# Altium schematic sheet 01-Microcontroller.SchDoc: Microcontroller
size A3; Engineer: Juan M Garin; Organization: ESO; Address1: Juan M Garin; DocumentNumber: 1; Revision: 1.0; SheetNumber: 1; SheetTotal: 6
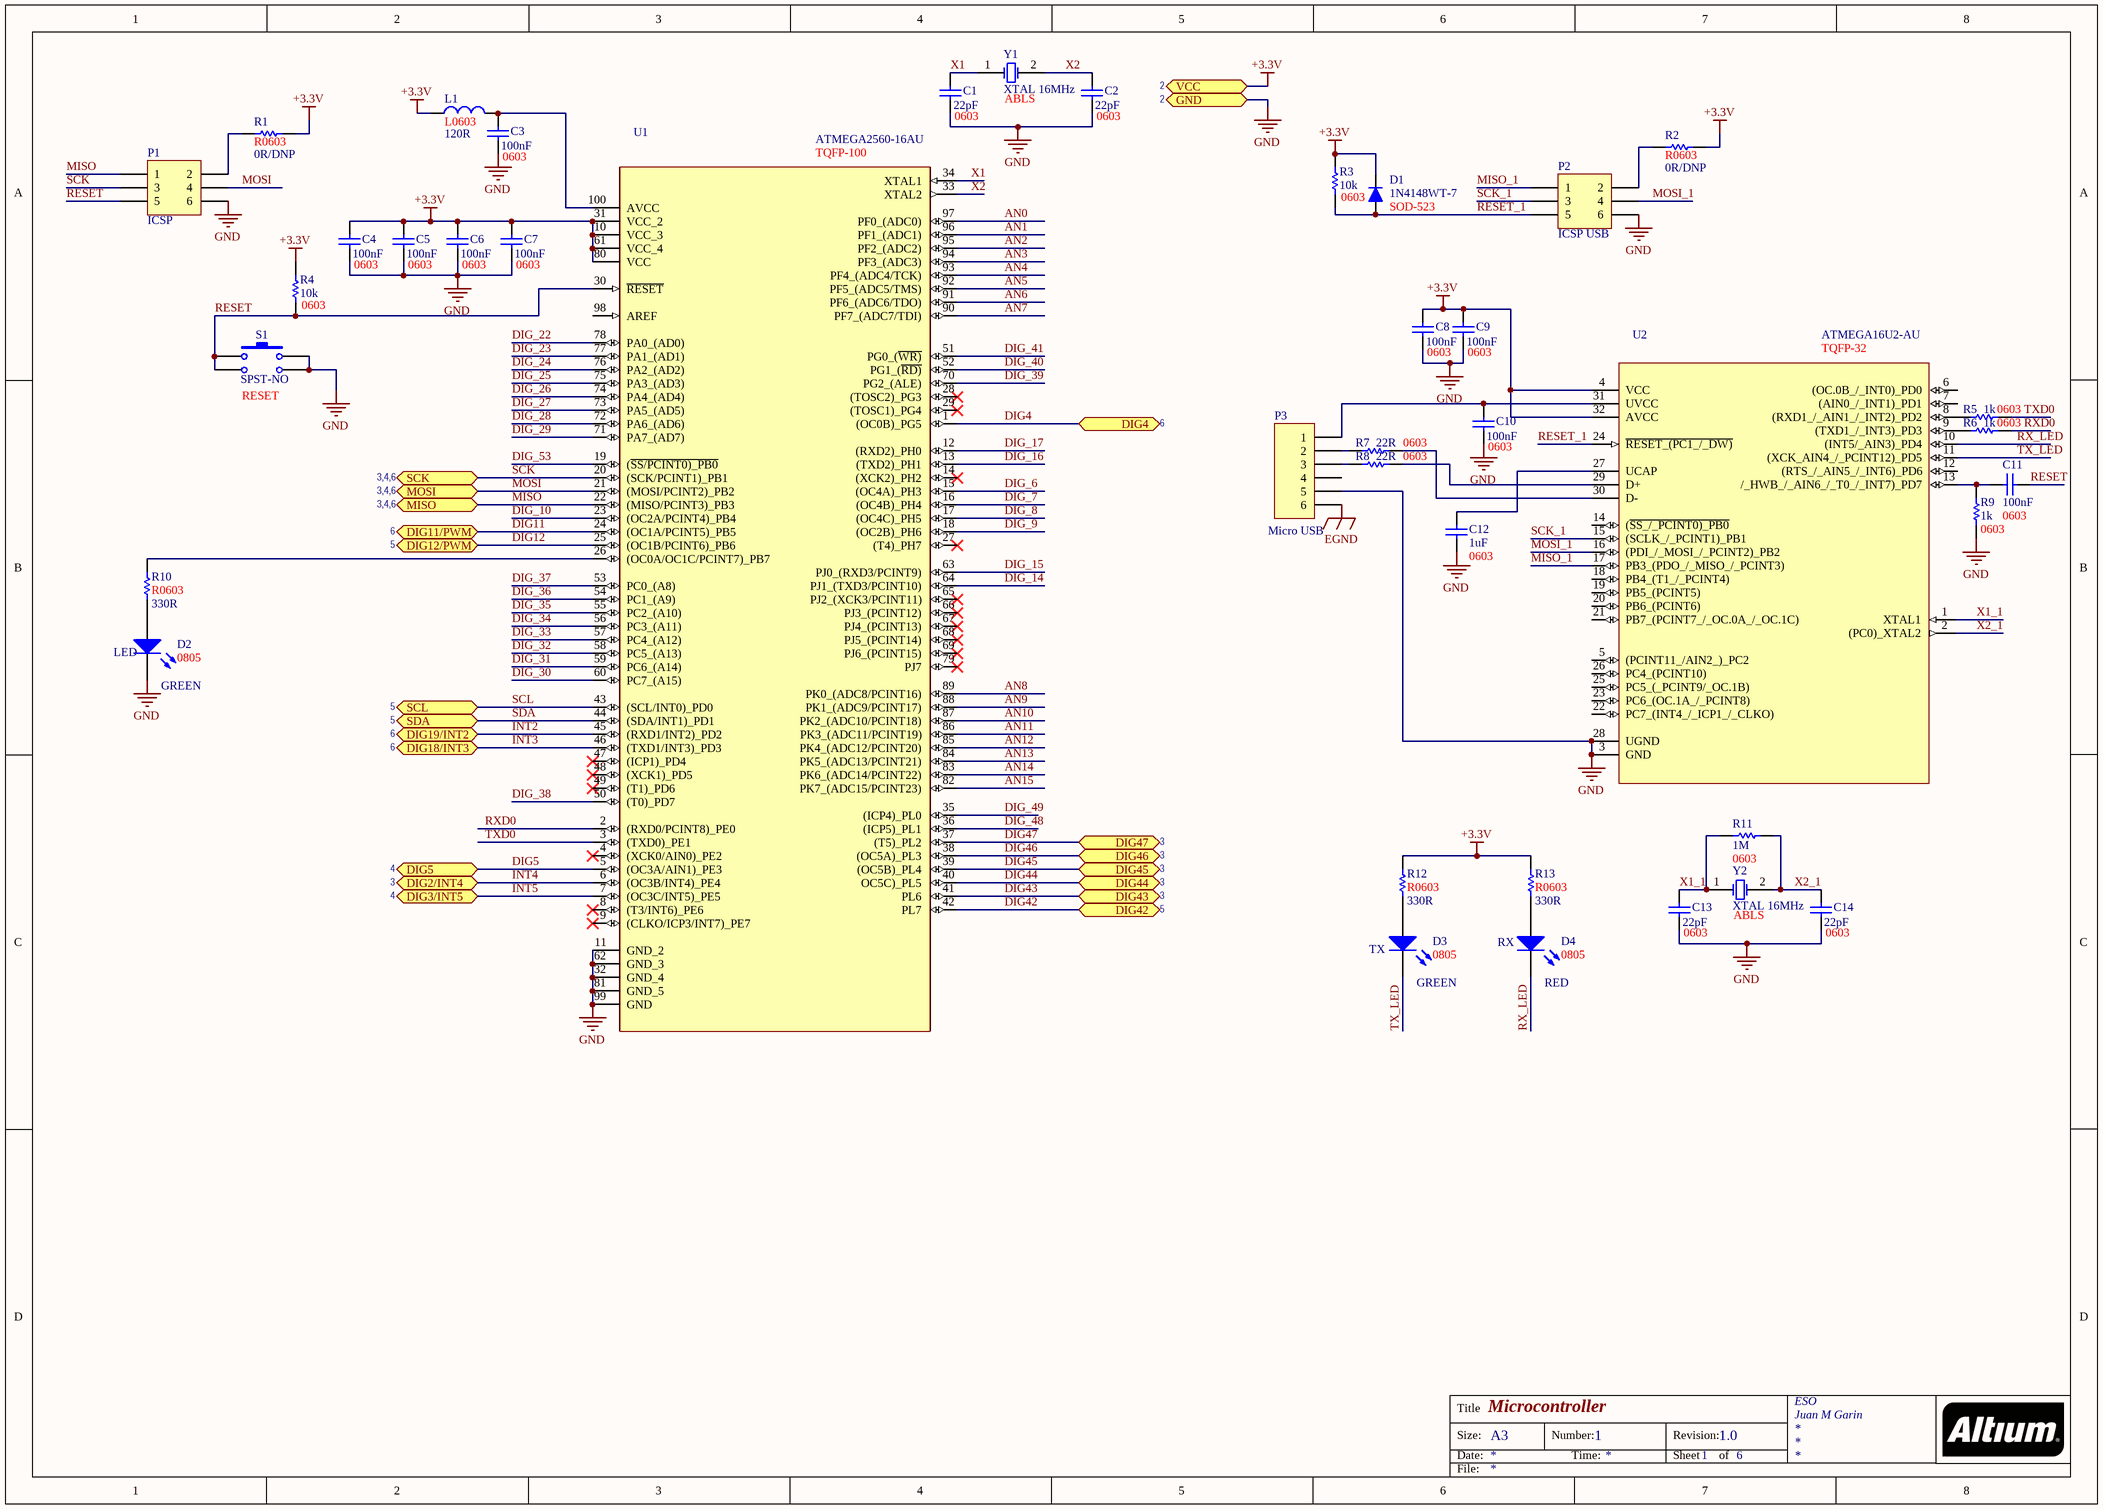
[diagram p0: 01-Microcontroller.SchDoc]

## Parts
C1  22pF  PackageReference: 0603  [C0603]
C2  22pF  PackageReference: 0603  [C0603]
C3  100nF  PackageReference: 0603  [C0603]
C4  100nF  PackageReference: 0603  [C0603]
C5  100nF  PackageReference: 0603  [C0603]
C6  100nF  PackageReference: 0603  [C0603]
C7  100nF  PackageReference: 0603  [C0603]
C8  100nF  PackageReference: 0603  [C0603]
C9  100nF  PackageReference: 0603  [C0603]
C10  100nF  PackageReference: 0603  [C0603]
C11  100nF  PackageReference: 0603  [C0603]
C12  1uF  PackageReference: 0603  [C0603]
C13  22pF  PackageReference: 0603  [C0603]
C14  22pF  PackageReference: 0603  [C0603]
D1  1N4148WT-7  PackageReference: SOD-523  [SOD523]
D2  LED  value GREEN  PackageReference: 0805  [LED0805]
D3  TX  value GREEN  PackageReference: 0805  [LED0805]
D4  RX  value RED  PackageReference: 0805  [LED0805]
L1  120R  [L0603]
P1  ICSP  [HDR2X3]
P2  ICSP USB  [HDR2X3]
P3  Micro USB  [CON_MOLEX_105133-0011]
R1  0R/DNP  [R0603]
R2  0R/DNP  [R0603]
R3  10k  PackageReference: 0603  [R0603]
R4  10k  PackageReference: 0603  [R0603]
R5  1k  PackageReference: 0603  [R0603]
R6  1k  PackageReference: 0603  [R0603]
R7  22R  PackageReference: 0603  [R0603]
R8  22R  PackageReference: 0603  [R0603]
R9  1k  PackageReference: 0603  [R0603]
R10  330R  [R0603]
R11  1M  PackageReference: 0603  [R0603]
R12  330R  [R0603]
R13  330R  [R0603]
S1  SPST-NO  Function: RESET  [DPST-4]
U1  ATMEGA2560-16AU  PackageReference: TQFP-100  [TQFP100]
U2  ATMEGA16U2-AU  Package: TQFP-32  [32A_N]
Y1  XTAL 16MHz  PackageReference: ABLS  [XTAL-SMD]
Y2  XTAL 16MHz  PackageReference: ABLS  [XTAL-SMD]

## Ports
DIG2/INT4, DIG3/INT5, DIG4, DIG5, DIG11/PWM, DIG12/PWM, DIG18/INT3, DIG19/INT2, DIG42, DIG43, DIG44, DIG45, DIG46, DIG47, GND, MISO, MOSI, SCK, SCL, SDA, VCC

## Nets
+3.3V: C4.2 C5.2 C6.2 C7.2 C8.2 C9.2 D1.2(K) L1.1 R1.2 R2.2 R3.1 R4.1 R12.2 R13.2 U1.10(VCC_3) U1.31(VCC_2) U1.61(VCC_4) U1.80(VCC) U2.4(VCC) U2.32(AVCC) ; port VCC
EGND: P3.6
GND: C1.1 C2.1 C3.1 C4.1 C5.1 C6.1 C7.1 C8.1 C9.1 C10.1 C12.2 C13.1 C14.1 D2.2(K) P1.6 P2.6 P3.5 R9.1 S1.3 S1.4 U1.11(GND_2) U1.32(GND_4) U1.62(GND_3) U1.81(GND_5) U1.99(GND) U2.3(GND) U2.28(UGND) ; port GND
AN0: U1.97(PF0_(ADC0))
AN1: U1.96(PF1_(ADC1))
AN2: U1.95(PF2_(ADC2))
AN3: U1.94(PF3_(ADC3))
AN4: U1.93(PF4_(ADC4/TCK))
AN5: U1.92(PF5_(ADC5/TMS))
AN6: U1.91(PF6_(ADC6/TDO))
AN7: U1.90(PF7_(ADC7/TDI))
AN8: U1.89(PK0_(ADC8/PCINT16))
AN9: U1.88(PK1_(ADC9/PCINT17))
AN10: U1.87(PK2_(ADC10/PCINT18))
AN11: U1.86(PK3_(ADC11/PCINT19))
AN12: U1.85(PK4_(ADC12/PCINT20))
AN13: U1.84(PK5_(ADC13/PCINT21))
AN14: U1.83(PK6_(ADC14/PCINT22))
AN15: U1.82(PK7_(ADC15/PCINT23))
DIG4: U1.1((OC0B)_PG5) ; port DIG4
DIG5: U1.5((OC3A/AIN1)_PE3) ; port DIG5
DIG11: U1.24((OC1A/PCINT5)_PB5) ; port DIG11/PWM
DIG12: U1.25((OC1B/PCINT6)_PB6) ; port DIG12/PWM
DIG42: U1.42(PL7) ; port DIG42
DIG43: U1.41(PL6) ; port DIG43
DIG44: U1.40(OC5C)_PL5) ; port DIG44
DIG45: U1.39((OC5B)_PL4) ; port DIG45
DIG46: U1.38((OC5A)_PL3) ; port DIG46
DIG47: U1.37((T5)_PL2) ; port DIG47
DIG_6: U1.15((OC4A)_PH3)
DIG_7: U1.16((OC4B)_PH4)
DIG_8: U1.17((OC4C)_PH5)
DIG_9: U1.18((OC2B)_PH6)
DIG_10: U1.23((OC2A/PCINT4)_PB4)
DIG_14: U1.64(PJ1_(TXD3/PCINT10))
DIG_15: U1.63(PJ0_(RXD3/PCINT9))
DIG_16: U1.13((TXD2)_PH1)
DIG_17: U1.12((RXD2)_PH0)
DIG_22: U1.78(PA0_(AD0))
DIG_23: U1.77(PA1_(AD1))
DIG_24: U1.76(PA2_(AD2))
DIG_25: U1.75(PA3_(AD3))
DIG_26: U1.74(PA4_(AD4))
DIG_27: U1.73(PA5_(AD5))
DIG_28: U1.72(PA6_(AD6))
DIG_29: U1.71(PA7_(AD7))
DIG_30: U1.60(PC7_(A15))
DIG_31: U1.59(PC6_(A14))
DIG_32: U1.58(PC5_(A13))
DIG_33: U1.57(PC4_(A12))
DIG_34: U1.56(PC3_(A11))
DIG_35: U1.55(PC2_(A10))
DIG_36: U1.54(PC1_(A9))
DIG_37: U1.53(PC0_(A8))
DIG_38: U1.50((T0)_PD7)
DIG_39: U1.70(PG2_(ALE))
DIG_40: U1.52(PG1_(~{RD)})
DIG_41: U1.51(PG0_(~{WR)})
DIG_48: U1.36((ICP5)_PL1)
DIG_49: U1.35((ICP4)_PL0)
DIG_53: U1.19((~{SS/PCINT0)_PB0})
INT2: U1.45((RXD1/INT2)_PD2) ; port DIG19/INT2
INT3: U1.46((TXD1/INT3)_PD3) ; port DIG18/INT3
INT4: U1.6((OC3B/INT4)_PE4) ; port DIG2/INT4
INT5: U1.7((OC3C/INT5)_PE5) ; port DIG3/INT5
MISO: P1.1 U1.22((MISO/PCINT3)_PB3) ; port MISO
MISO_1: P2.1 U2.17(PB3_(PDO_/_MISO_/_PCINT3))
MOSI: P1.4 U1.21((MOSI/PCINT2)_PB2) ; port MOSI
MOSI_1: P2.4 U2.16((PDI_/_MOSI_/_PCINT2)_PB2)
RESET: C11.1 P1.5 R4.2 S1.1 S1.2 U1.30(~{RESET})
RESET_1: D1.1(A) P2.5 R3.2 U2.24(~{RESET_(PC1_/_DW)})
RX_LED: D4.2(K) U2.10((INT5/_AIN3)_PD4)
RXD0: R6.2 U1.2((RXD0/PCINT8)_PE0)
SCK: P1.3 U1.20((SCK/PCINT1)_PB1) ; port SCK
SCK_1: P2.3 U2.15((SCLK_/_PCINT1)_PB1)
SCL: U1.43((SCL/INT0)_PD0) ; port SCL
SDA: U1.44((SDA/INT1)_PD1) ; port SDA
TX_LED: D3.2(K) U2.11((XCK_AIN4_/_PCINT12)_PD5)
TXD0: R5.2 U1.3((TXD0)_PE1)
X1: C1.2 U1.34(XTAL1) Y1.1(OSC1)
X1_1: C13.2 R11.2 U2.1(XTAL1) Y2.1(OSC1)
X2: C2.2 U1.33(XTAL2) Y1.2(OSC2)
X2_1: C14.2 R11.1 U2.2((PC0)_XTAL2) Y2.2(OSC2)
NetC3_2: C3.2 L1.2 U1.100(AVCC)
NetC10_2: C10.2 P3.1 U2.31(UVCC)
NetC11_2: C11.2 R9.2 U2.13(/_HWB_/_AIN6_/_T0_/_INT7)_PD7)
NetC12_1: C12.1 U2.27(UCAP)
NetD2_1: D2.1(A) R10.1
NetD3_1: D3.1(A) R12.1
NetD4_1: D4.1(A) R13.1
NetP1_2: P1.2 R1.1
NetP2_2: P2.2 R2.1
NetP3_2: P3.2 R7.2
NetP3_3: P3.3 R8.2
NetR5_1: R5.1 U2.8((RXD1_/_AIN1_/_INT2)_PD2)
NetR6_1: R6.1 U2.9((TXD1_/_INT3)_PD3)
NetR7_1: R7.1 U2.30(D-)
NetR8_1: R8.1 U2.29(D+)
NetR10_2: R10.2 U1.26((OC0A/OC1C/PCINT7)_PB7)

Not connected (* = marked no-connect by the designer): P3 4; U1 4((XCK0/AIN0)_PE2)* 8((T3/INT6)_PE6)* 9((CLKO/ICP3/INT7)_PE7)* 14((XCK2)_PH2)* 27((T4)_PH7)* 28((TOSC2)_PG3)* 29((TOSC1)_PG4)* 47((ICP1)_PD4)* 48((XCK1)_PD5)* 49((T1)_PD6)* 65(PJ2_(XCK3/PCINT11))* 66(PJ3_(PCINT12))* 67(PJ4_(PCINT13))* 68(PJ5_(PCINT14))* 69(PJ6_(PCINT15))* 79(PJ7)* 98(AREF); U2 5((PCINT11_/AIN2_)_PC2) 6((OC.0B_/_INT0)_PD0) 7((AIN0_/_INT1)_PD1) 12((RTS_/_AIN5_/_INT6)_PD6) 14((~{SS_/_PCINT0)_PB0}) 18(PB4_(T1_/_PCINT4)) 19(PB5_(PCINT5)) 20(PB6_(PCINT6)) 21(PB7_(PCINT7_/_OC.0A_/_OC.1C)) 22(PC7_(INT4_/_ICP1_/_CLKO)) 23(PC6_(OC.1A_/_PCINT8)) 25(PC5_(_PCINT9/_OC.1B)) 26(PC4_(PCINT10))

## Notes on the sheet
- 2
- 6
- 3,4,6
- 5
- 3
- 4
- Title
- Size:
- Date:
- A3
- Number:
- Time:
- Revision:
- Sheet
- of
- File:

## Library data of the parts
C1 C2 C13 C14 = Cap Semi: Capacitor (Semiconductor SIM Model); Manufacturer Part Number: 885012006004; Value: 22pF
C3-C11 = Cap Semi: Capacitor (Semiconductor SIM Model); Manufacturer Part Number: CL10F104ZO8NNNC; Value: 100nF
C12 = Cap Semi: Capacitor (Semiconductor SIM Model); Manufacturer Part Number: CL10A105KQ8NNNC; Value: 1uF
D1 = DIODE: Manufacturer Part Number: 1N4148WT-7
D2 D3 = LED_SMD: GREEN; Manufacturer Part Number: LTST-S220GKT
D4 = LED_SMD: YLW; Manufacturer Part Number: LTST-C171KRKT
L1 = Inductor_0603: Inductor; Manufacturer Part Number: BLM18PG121SN1D; PackageReference: L0603; Value: 120R
P1 P2 = Header 3X2: Header, 3-Pin, Dual row; Manufacturer Part Number: 5-146254-3
P3 = Header 6: CONN MICRO USB B 2.0 VERT SMT; Manufacturer Part Number: 1051330011
R1 R2 = Res_0402: Resistor; Manufacturer Part Number: CR0603-J/-000ELF; PackageReference: R0603; Value: 0R/DNP
R3 R4 = Res1: Resistor; Manufacturer Part Number: RMCF0603FT10K0; Value: 10k
R5 R6 R9 = Res1: Resistor; Manufacturer Part Number: RMCF0603FG1K00; Value: 1k
R7 R8 = Res1: Resistor; Manufacturer Part Number: CRGCQ0603J22R; Value: 22R
R10 R12 R13 = Res_0402: Resistor; Manufacturer Part Number: RMCF0603JT330R; PackageReference: R0603; Value: 330R
R11 = Res1: Resistor; Manufacturer Part Number: RMCF0603FG1M00; Value: 1M
S1 = SW-PB: Switch; Manufacturer Part Number: PTS645SM43SMTR92 LFS; PackageReference: SPST-NO
U1 = ATMEGA2560-16AU: Embedded microcontroller ATMEGA2560-16AU TQFP 100 _14x14_ Microchip Technology 8-Bit 16 MHz I/O number 86; Manufacturer Part Number: ATMEGA2560-16AU
U2 = ATMEGA16U2-AU: MCU 8-bit ATmega AVR RISC 16KB Flash 3.3V/5V 32-Pin TQFP; Manufacturer Part Number: ATMEGA16U2-AU
Y1 Y2 = XTAL 16MHz: Crystal Oscillator 16MHz SMD; Manufacturer Part Number: ABLS-16.000MHZ-B2-T; Value: XTAL 16MHz